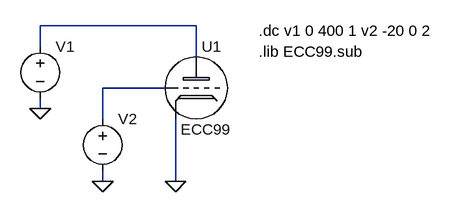
[diagram p0: schematic ECC99.asc]
ECC99.asc, the LTspice schematic file:
Version 4
SHEET 1 1020 680
WIRE 496 208 256 208
WIRE 256 240 256 208
WIRE 496 256 496 208
WIRE 448 304 352 304
WIRE 256 336 256 320
WIRE 352 352 352 304
WIRE 352 448 352 432
WIRE 464 448 464 352
FLAG 256 336 0
FLAG 464 448 0
FLAG 352 448 0
SYMBOL voltage 256 224 R0
SYMATTR InstName V1
SYMATTR Value ""
SYMBOL voltage 352 336 R0
SYMATTR InstName V2
SYMATTR Value ""
SYMBOL ECC99 496 304 R0
SYMATTR InstName U1
TEXT 592 248 Left 2 !.lib ECC99.sub
TEXT 592 216 Left 2 !.dc v1 0 400 1 v2 -20 0 2

The netlist it stands for:
* ECC99.asc
V1 N001 0
V2 N002 0
XU1 N001 N002 0 ECC99  ; pins Plate Grid Cathode
.lib ECC99.sub
.dc v1 0 400 1 v2 -20 0 2
.lib ECC99.sub
.backanno
.end